# EAGLE design OmniBot_motor_driver (EAGLE 9.4.2)
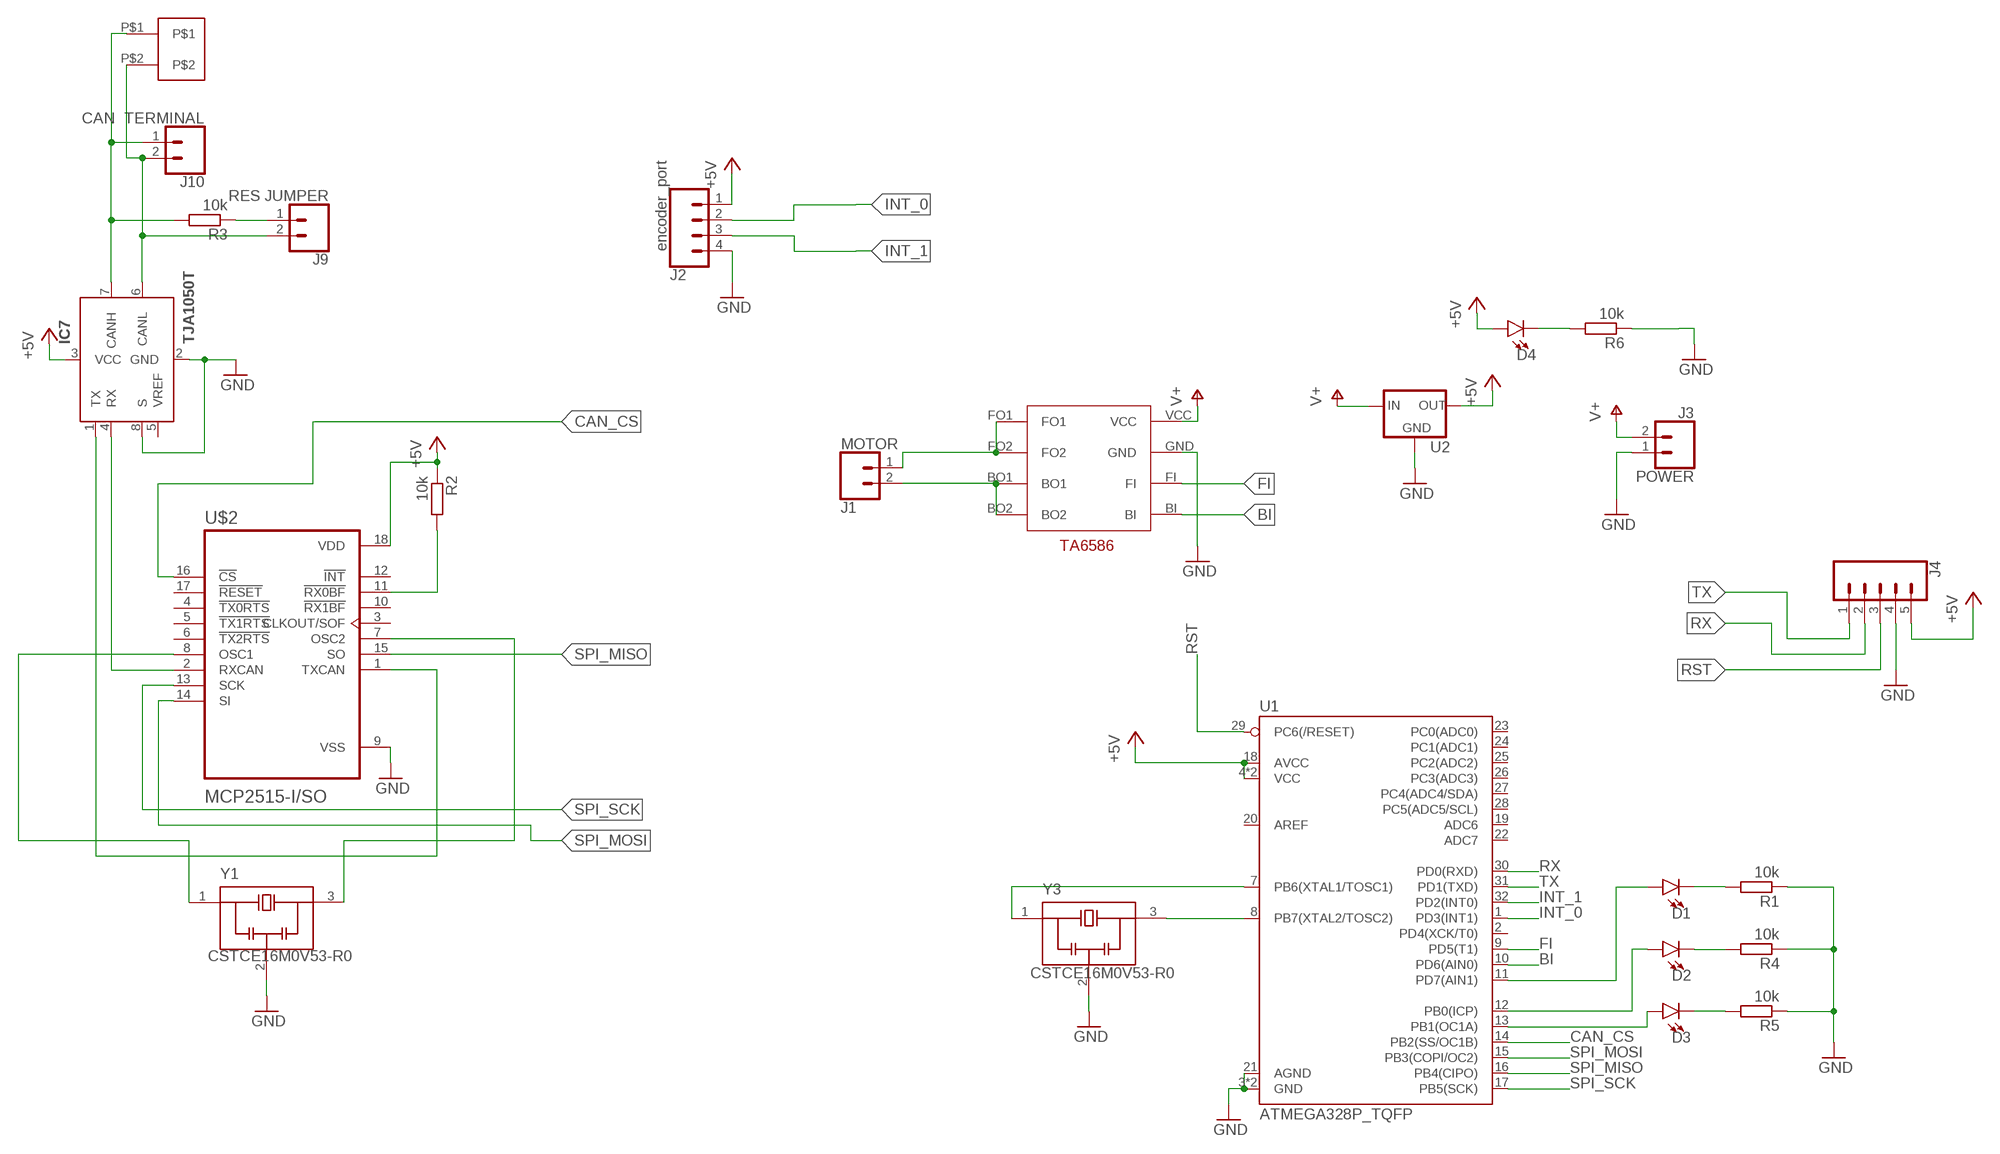
[diagram p0: schematic, sheet 1]

## Parts
D1  LED3MM  [LED_3MM]
D2  LED3MM  [LED_3MM]
D3  LED3MM  [LED_3MM]
D4  LED3MM  [LED_3MM]
IC7  TJA1050T  [SOIC8]
J1  MOTOR  CONN_025MM  [SCREWTERMINAL-5MM-2]
J2  encoder_port  CONN_04POLAR  [MOLEX-1X4]
J3  POWER  CONN_025MM  [SCREWTERMINAL-5MM-2]
J4  CONN_05PTH  [1X05]
J9  RES JUMPER  CONN_02  [1X02]
J10  CAN TERMINAL  CONN_025MM  [SCREWTERMINAL-5MM-2]
R1  10k  R-EU_R0805  [R0805]
R2  10k  R-EU_R0805  [R0805]
R3  10k  R-EU_R0805  [R0805]
R4  10k  R-EU_R0805  [R0805]
R5  10k  R-EU_R0805  [R0805]
R6  10k  R-EU_R0805  [R0805]
U1  ATMEGA328P_TQFP  [TQFP32-08]
U2  V_REG_78XXSINK  [TO220-IGO]
U$1  15EDGRC-3.5-2P  [15EDGRC-3.5-2P-PAK]
U$2  MCP2515-I/SO  [SOIC127P1030X265-18N]
U$3  TA6586  [TA6586-FOOTPRINT]
Y1  CSTCE16M0V53-R0  [OSC_CSTCE16M0V53-R0]
Y3  CSTCE16M0V53-R0  [OSC_CSTCE16M0V53-R0]

## Nets
+5V: D4.A IC7.3(VCC) J2.1 J4.5 R2.1 U1.4(VCC) U1.6(VCC) U1.18(AVCC) U2.OUT U$2.18(VDD)
BI: U1.10(PD6(AIN0)) U$3.BI
CAN_CS: U1.14(PB2(SS/OC1B)) U$2.16(!CS)
FI: U1.9(PD5(T1)) U$3.FI
GND: IC7.2(GND) IC7.8(S) J2.4 J3.1 J4.4 R1.1 R4.1 R5.1 R6.1 U1.3(GND) U1.5(GND) U1.21(AGND) U2.GND U$2.9(VSS) U$3.GND Y1.2(GND) Y3.2(GND)
INT_0: J2.2 U1.1(PD3(INT1))
INT_1: J2.3 U1.32(PD2(INT0))
N$1: U1.8(PB7(XTAL2/TOSC2)) Y3.3(OUT)
N$2: U$2.8(OSC1) Y1.1(IN)
N$3: U1.7(PB6(XTAL1/TOSC1)) Y3.1(IN)
N$4: IC7.1(TX) U$2.1(TXCAN)
N$5: IC7.4(RX) U$2.2(RXCAN)
N$6: R2.2 U$2.11(!RX0BF)
N$7: J1.1 U$3.FO1 U$3.FO2
N$8: J1.2 U$3.BO1 U$3.BO2
N$9: U$2.7(OSC2) Y1.3(OUT)
N$10: IC7.6(CANL) J9.2 J10.2 U$1.P$2
N$11: D1.A U1.11(PD7(AIN1))
N$12: J9.1 R3.1
N$13: IC7.7(CANH) J10.1 R3.2 U$1.P$1
N$14: D2.A U1.12(PB0(ICP))
N$15: D3.A U1.13(PB1(OC1A))
N$16: D1.K(C) R1.2
N$17: D2.K(C) R4.2
N$18: D3.K(C) R5.2
N$19: D4.K(C) R6.2
RST: J4.3 U1.29(PC6(/RESET))
RX: J4.2 U1.30(PD0(RXD))
SPI_MISO: U1.16(PB4(CIPO)) U$2.15(SO)
SPI_MOSI: U1.15(PB3(COPI/OC2)) U$2.14(SI)
SPI_SCK: U1.17(PB5(SCK)) U$2.13(SCK)
TX: J4.1 U1.31(PD1(TXD))
V+: J3.2 U2.IN U$3.VCC
Unconnected: IC7.5(VREF) U1.2(PD4(XCK/T0)) U1.19(ADC6) U1.20(AREF) U1.22(ADC7) U1.23(PC0(ADC0)) U1.24(PC1(ADC1)) U1.25(PC2(ADC2)) U1.26(PC3(ADC3)) U1.27(PC4(ADC4/SDA)) U1.28(PC5(ADC5/SCL)) U$2.3(CLKOUT/SOF) U$2.4(!TX0RTS) U$2.5(!TX1RTS) U$2.6(!TX2RTS) U$2.10(!RX1BF) U$2.12(!INT) U$2.17(!RESET)

## Library data of the parts
D1-D4 = SparkFun-LED:LED: LED (Generic) Standard schematic elements and footprints for 5mm, 3mm, 1206, and 0603 sized LEDs. Generic LEDs with no color specified.; PROD_ID: DIO-08794
IC7 = TJA1050:TJA1050; MF: NXP; MPN: TJA1050T
J1 J3 J10 = SparkFun-Connectors:CONN_02: Multi connection point. Often used as Generic Header-pin footprint for 0.1 inch spaced/style header connections On any of the 0.1 inch spaced packages, you can populate with these: Break Away Headers - Straight <https://www.sparkfun.com/products/116> (PRT-00116) Break Away Male Headers - Right Angle <https://www.sparkfun.com/products/553> (PRT-00553) Female Headers <https://www.sparkfun.com/products/115> (PRT-00115) Break Away Headers - Machine Pin <https://www.sparkfun.com/products/117> (PRT-00117) Break Away Female Headers - Swiss Machine Pin <https://www.sparkfun.com/products/743> (PRT-00743) For SCREWTERMINALS and SPRING TERMINALS visit here: Screw Terimnals on SparkFun.com <https://www.sparkfun.com/search/results?term=Screw+Terminals> (5mm/3.5mm/2.54mm spacing) This device is also useful as a general connection point to wire up your design to another part of your project. Our various solder wires solder well into these plated through hole pads. Hook-Up Wire - Assortment (Stranded, 22 AWG) <https://www.sparkfun.com/products/11375> (PRT-11375) Hook-Up Wire - Assortment (Solid Core, 22 AWG) <https://www.sparkfun.com/products/11367> (PRT-11367) View the entire wire category on our website here <https://www.sparkfun.com/categories/141> Special notes: Molex polarized connector foot print use with: PRT-08233 with associated crimp pins and housings. 2.54_SCREWTERM for use with PRT-10571. 3.5mm Screw Terminal footprints for PRT-08084 5mm Screw Terminal footprints for use with PRT-08432; SF_SKU: PRT-08432
J2 = SparkFun-Connectors:CONN_04: Multi connection point. Often used as Generic Header-pin footprint for 0.1 inch spaced/style header connections On any of the 0.1 inch spaced packages, you can populate with these: Break Away Headers - Straight <https://www.sparkfun.com/products/116> (PRT-00116) Break Away Male Headers - Right Angle <https://www.sparkfun.com/products/553> (PRT-00553) Female Headers <https://www.sparkfun.com/products/115> (PRT-00115) Break Away Headers - Machine Pin <https://www.sparkfun.com/products/117> (PRT-00117) Break Away Female Headers - Swiss Machine Pin <https://www.sparkfun.com/products/743> (PRT-00743) For SCREWTERMINALS and SPRING TERMINALS visit here: Screw Terimnals on SparkFun.com <https://www.sparkfun.com/search/results?term=Screw+Terminals> (5mm/3.5mm/2.54mm spacing) This device is also useful as a general connection point to wire up your design to another part of your project. Our various solder wires solder well into these plated through hole pads. Hook-Up Wire - Assortment (Stranded, 22 AWG) <https://www.sparkfun.com/products/11375> (PRT-11375) Hook-Up Wire - Assortment (Solid Core, 22 AWG) <https://www.sparkfun.com/products/11367> (PRT-11367) View the entire wire category on our website here <https://www.sparkfun.com/categories/141> Special notes: Molex polarized connector foot print use with SKU : PRT-08231 with associated crimp pins and housings. 1MM SMD Version SKU: PRT-10208; PROD_ID: CONN-08186; SF_ID: PRT-08231
J4 = SparkFun-Connectors:CONN_05: Multi connection point. Often used as Generic Header-pin footprint for 0.1 inch spaced/style header connections On any of the 0.1 inch spaced packages, you can populate with these: Break Away Headers - Straight <https://www.sparkfun.com/products/116> (PRT-00116) Break Away Male Headers - Right Angle <https://www.sparkfun.com/products/553> (PRT-00553) Female Headers <https://www.sparkfun.com/products/115> (PRT-00115) Break Away Headers - Machine Pin <https://www.sparkfun.com/products/117> (PRT-00117) Break Away Female Headers - Swiss Machine Pin <https://www.sparkfun.com/products/743> (PRT-00743) For SCREWTERMINALS and SPRING TERMINALS visit here: Screw Terimnals on SparkFun.com <https://www.sparkfun.com/search/results?term=Screw+Terminals> (5mm/3.5mm/2.54mm spacing) This device is also useful as a general connection point to wire up your design to another part of your project. Our various solder wires solder well into these plated through hole pads. Hook-Up Wire - Assortment (Stranded, 22 AWG) <https://www.sparkfun.com/products/11375> (PRT-11375) Hook-Up Wire - Assortment (Solid Core, 22 AWG) <https://www.sparkfun.com/products/11367> (PRT-11367) View the entire wire category on our website here <https://www.sparkfun.com/categories/141> Special notes: Molex polarized connector foot print use with SKU : PRT-08231 with associated crimp pins and housings. 1MM SMD Version SKU: PRT-10208
J9 = SparkFun-Connectors:CONN_02: Multi connection point. Often used as Generic Header-pin footprint for 0.1 inch spaced/style header connections On any of the 0.1 inch spaced packages, you can populate with these: Break Away Headers - Straight <https://www.sparkfun.com/products/116> (PRT-00116) Break Away Male Headers - Right Angle <https://www.sparkfun.com/products/553> (PRT-00553) Female Headers <https://www.sparkfun.com/products/115> (PRT-00115) Break Away Headers - Machine Pin <https://www.sparkfun.com/products/117> (PRT-00117) Break Away Female Headers - Swiss Machine Pin <https://www.sparkfun.com/products/743> (PRT-00743) For SCREWTERMINALS and SPRING TERMINALS visit here: Screw Terimnals on SparkFun.com <https://www.sparkfun.com/search/results?term=Screw+Terminals> (5mm/3.5mm/2.54mm spacing) This device is also useful as a general connection point to wire up your design to another part of your project. Our various solder wires solder well into these plated through hole pads. Hook-Up Wire - Assortment (Stranded, 22 AWG) <https://www.sparkfun.com/products/11375> (PRT-11375) Hook-Up Wire - Assortment (Solid Core, 22 AWG) <https://www.sparkfun.com/products/11367> (PRT-11367) View the entire wire category on our website here <https://www.sparkfun.com/categories/141> Special notes: Molex polarized connector foot print use with: PRT-08233 with associated crimp pins and housings. 2.54_SCREWTERM for use with PRT-10571. 3.5mm Screw Terminal footprints for PRT-08084 5mm Screw Terminal footprints for use with PRT-08432
R1-R6 = resistor:R-EU_: RESISTOR, European symbol
U1 = SparkFun-IC-Microcontroller:ATMEGA328P_TQFP: Popular 328P in QFP Storefront component: ATmega328 - TQFP <https://www.sparkfun.com/products/13448> (COM-13448) Datasheet <http://www.sparkfun.com/datasheets/Components/SMD/ATMega328.pdf> SparkFun Products SparkFun RedBoard - Programmed with Arduino <https://www.sparkfun.com/products/12757> (DEV-12757) Arduino Pro Mini 328 - 5V/16MHz <https://www.sparkfun.com/products/11113> (DEV-11113) Arduino Pro Mini 328 - 3.3V/8MHz <https://www.sparkfun.com/products/11114> (DEV-11114) SparkFun OpenLog <https://www.sparkfun.com/products/13712> (DEV-13712) SparkFun MicroView - OLED Arduino Module <https://www.sparkfun.com/products/12923> (DEV-12923) SparkFun Digital Sandbox <https://www.sparkfun.com/products/12651> (DEV-12651) SparkFun PicoBoard <https://www.sparkfun.com/products/11888> (WIG-11888) Arduino Fio <https://www.sparkfun.com/products/10116> (DEV-10116) LilyPad Arduino 328 Main Board <https://www.sparkfun.com/products/13342> (DEV-13342) SparkFun RedStick <https://www.sparkfun.com/products/13741> (DEV-13741) LilyPad MP3 <https://www.sparkfun.com/products/11013> (DEV-11013) LilyPad Arduino SimpleSnap <https://www.sparkfun.com/products/10941> (DEV-10941) SparkFun Stepoko <https://www.sparkfun.com/products/13899> (ROB-13899) SparkFun Geiger Counter <https://www.sparkfun.com/products/11345> (SEN-11345) SparkFun EL Sequencer <https://www.sparkfun.com/products/12781> (COM-12781) Arduino Pro 328 - 5V/16MHz <https://www.sparkfun.com/products/10915> (DEV-10915) CryptoCape <https://www.sparkfun.com/products/12773> (DEV-12773) SparkFun IR Thermometer Evaluation Board - MLX90614 <https://www.sparkfun.com/products/10740> (SEN-10740) SparkFun RedBot Mainboard <https://www.sparkfun.com/products/12097> (ROB-12097) Arduino Pro 328 - 3.3V/8MHz <https://www.sparkfun.com/products/10914> (DEV-10914) SparkFun Block for Intel® Edison - Arduino <https://www.sparkfun.com/products/13036> (DEV-13036) SparkFun Simon Says - Surface Mount Soldering Kit <https://www.sparkfun.com/products/10935> (KIT-10935) SparkFun 7-Segment Serial Display - Red <https://www.sparkfun.com/products/11441> (COM-11441) SparkFun 7-Segment Serial Display - White <https://www.sparkfun.com/products/11629> (COM-11629) SparkFun 7-Segment Serial Display - Yellow <https://www.sparkfun.com/products/11443> (COM-11443) SparkFun 7-Segment Serial Display - Kelly Green <https://www.sparkfun.com/products/11440> (COM-11440) SparkFun 7-Segment Serial Display - Blue <https://www.sparkfun.com/products/11442> (COM-11442) SparkFun OpenSegment Serial Display - 20mm (Blue) <https://www.sparkfun.com/products/11647> (COM-11647) SparkFun OpenSegment Serial Display - 20mm (Green) <https://www.sparkfun.com/products/11646> (COM-11646) SparkFun OpenSegment Serial Display - 20mm (White) <https://www.sparkfun.com/products/11648> (COM-11648) SparkFun OpenSegment Serial Display - 20mm (Red) <https://www.sparkfun.com/products/11644> (COM-11644) SparkFun OpenSegment Serial Display - 20mm (Yellow) <https://www.sparkfun.com/products/11645> (COM-11645) SparkFun OpenSegment Shield <https://www.sparkfun.com/products/13190> (DEV-13190); PROD_ID: IC-09069
U2 = SparkFun-IC-Power:V_REG_78XX: Voltage Regulator Standard 78xx regulator. IGO (Input Ground Output). Spark Fun Electronics SKU : COM-00107
U$1 = 15EDGRC-3.5-2P:15EDGRC-3.5-2P: Check availability <https://pricing.snapeda.com/parts/15EDGRC-3.5/2P/Degson/view-part?ref=eda>; AVAILABILITY: Not in stock; CHECK_PRICES: https://www.snapeda.com/parts/15EDGRC-3.5/2P/Degson/view-part/?ref=eda; DESCRIPTION: Pluggable terminal block; socket; male; 3.5mm; angled 90°; ways: 2; MF: Degson; MP: 15EDGRC-3.5/2P; PACKAGE: None; PRICE: None; SNAPEDA_LINK: https://www.snapeda.com/parts/15EDGRC-3.5/2P/Degson/view-part/?ref=snap
U$2 = MCP2515-I_SO:MCP2515-I/SO: Check availability <https://pricing.snapeda.com/parts/MCP2515-I/SO/Microchip/view-part?ref=eda>; AVAILABILITY: In Stock; CHECK_PRICES: https://www.snapeda.com/parts/MCP2515-I/SO/Microchip/view-part/?ref=eda; DESCRIPTION: Microchip CAN Controller 1Mbit/s CAN 2.0B 18-Pin SOIC W | Microchip Technology Inc. MCP2515-I/SO; MF: Microchip; MP: MCP2515-I/SO; PACKAGE: SOIC-18 Microchip; PRICE: None; PURCHASE-URL: https://www.snapeda.com/api/url_track_click_mouser/?unipart_id=39881&manufacturer=Microchip&part_name=MCP2515-I/SO&search_term=None; SNAPEDA_LINK: https://www.snapeda.com/parts/MCP2515-I/SO/Microchip/view-part/?ref=snap
U$3 = TA6586:TA6586: Check availability <https://pricing.snapeda.com/parts/TA6586/Wuxi/view-part?ref=eda>; AVAILABILITY: Not in stock; CHECK_PRICES: https://www.snapeda.com/parts/TA6586/Wuxi/view-part/?ref=eda; DESCRIPTION: DC Bidirectional motor driving circuit; MF: Wuxi; MP: TA6586; PACKAGE: Package; PRICE: None; SNAPEDA_LINK: https://www.snapeda.com/parts/TA6586/Wuxi/view-part/?ref=snap
Y1 Y3 = CSTCE16M0V53-R0:CSTCE16M0V53-R0: Check availability <https://pricing.snapeda.com/parts/CSTCE16M0V53-R0/Murata/view-part?ref=eda>; AVAILABILITY: In Stock; CHECK_PRICES: https://www.snapeda.com/parts/CSTCE16M0V53-R0/Murata+Electronics+North+America/view-part/?ref=eda; DESCRIPTION: 16 MHz Ceramic Resonator Built in Capacitor 15 pF ±0.3% -20°C ~ 80°C Surface Mount; MF: Murata; MP: CSTCE16M0V53-R0; PACKAGE: SMD-3 Murata; PRICE: None; SNAPEDA_LINK: https://www.snapeda.com/parts/CSTCE16M0V53-R0/Murata+Electronics+North+America/view-part/?ref=snap

## Net classes
0 default: width 0.5 mm, drill 1.2 mm, clearance 0.2 mm

## Board
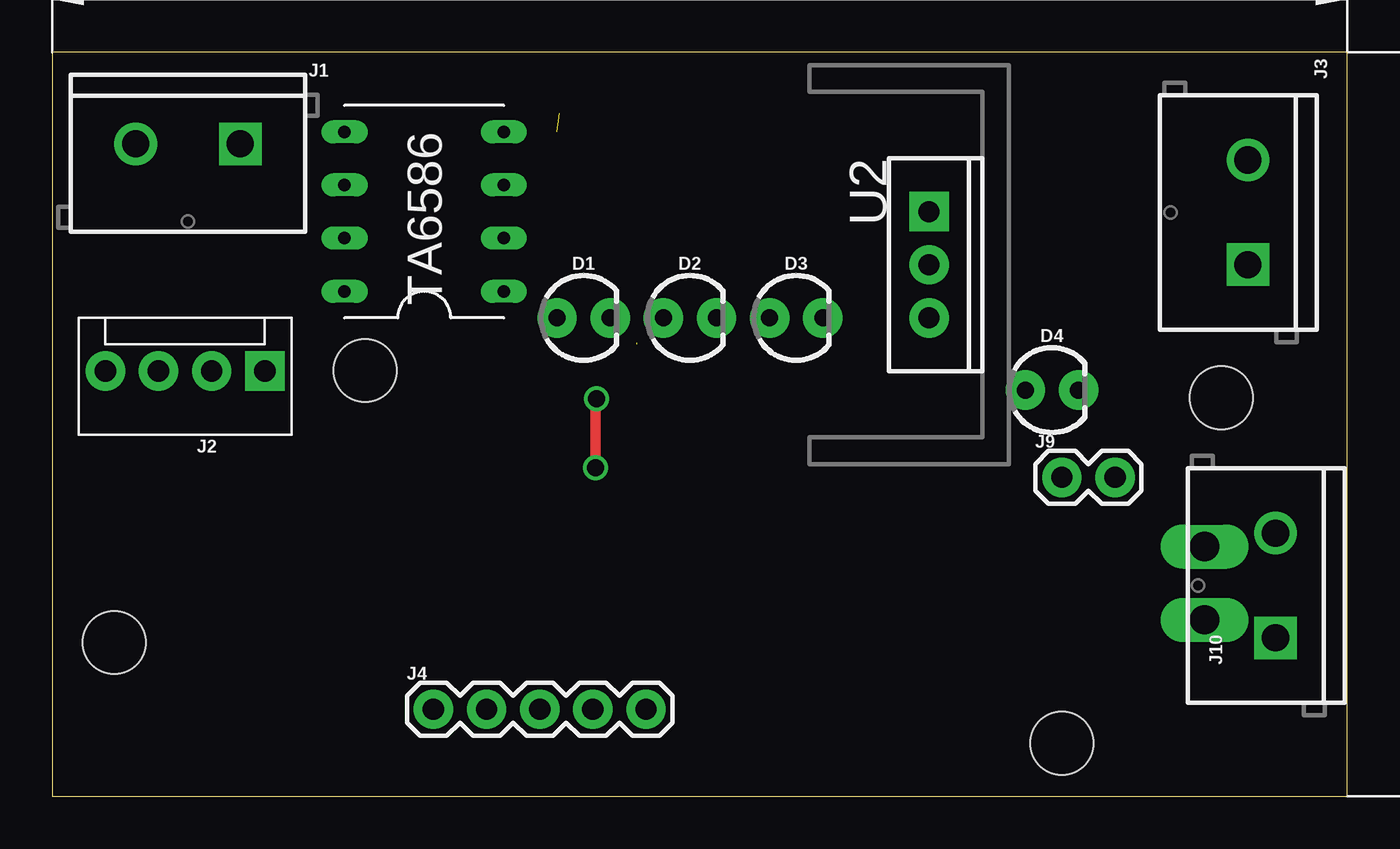
[diagram p1: board, top side]
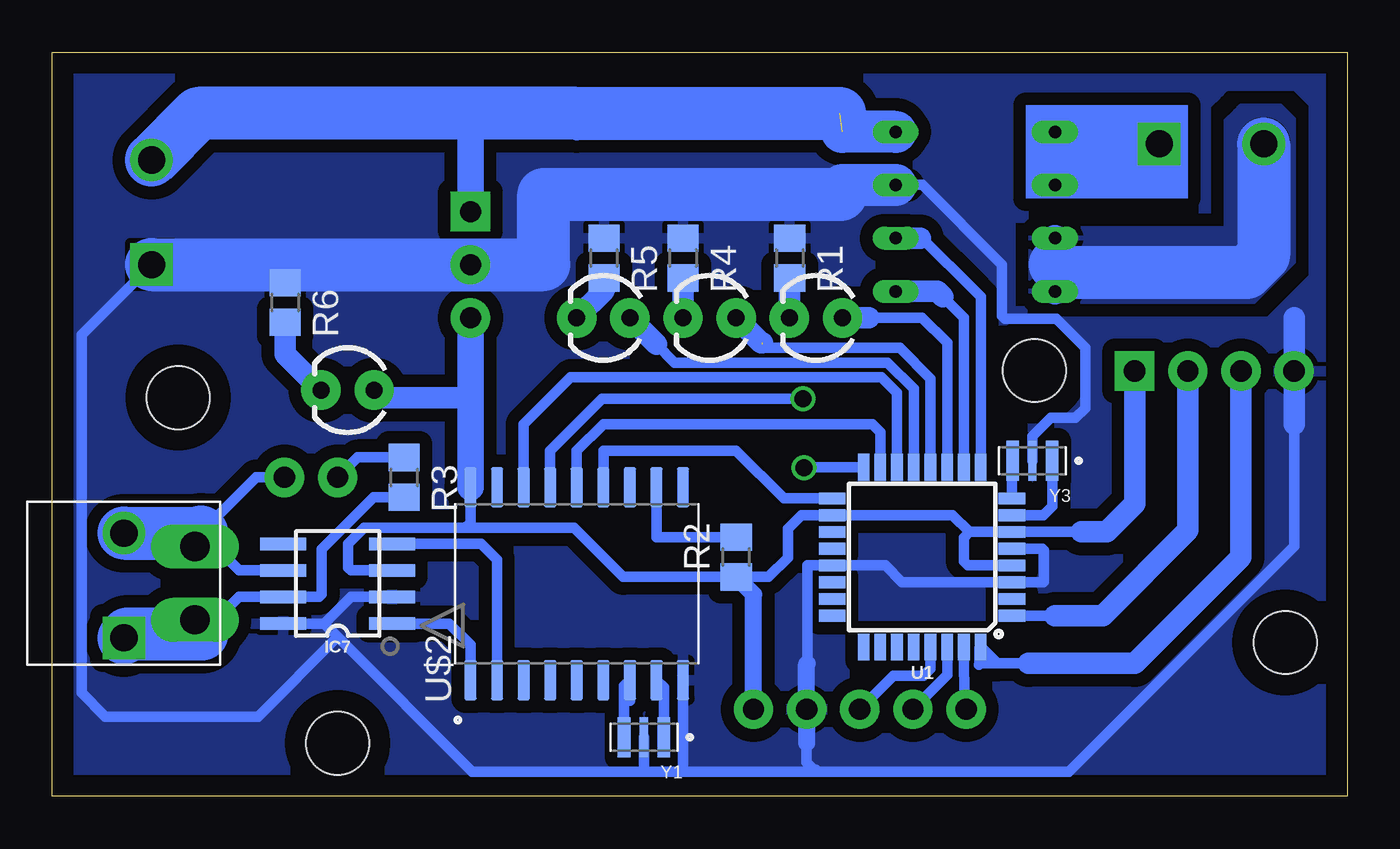
[diagram p2: board, bottom side, seen from below]

Size 61.9 x 35.55 mm. Coordinates in mm from the lower left corner, seen from the top.
Outline: 0,0 61.9,0 61.9,35.55 0,35.55 0,0
Copper layers (1*16): Top 0.035mm / dielectric 1.5mm / Bottom 0.035mm
Design rules "default": minimum track width 6mil, minimum drill 0.35mm, track to track 6mil, track to pad 6mil, pad to pad 6mil, via to via 6mil, smd to smd 6mil, copper to edge 40mil, drill to drill 6mil, minimum pad ring 10mil, minimum via ring 8mil, stop-mask expansion 4mil, vias tented up to drill 0mil, thermal gap 10mil
Holes 3 mm at 2.97,7.35 48.26,2.54 55.88,19.05 14.95,20.34

### Footprints (pad centres in the part's own frame; a part is rotated, then mirrored left to right if it is on the bottom)
LED_3MM = drill 0.813 pad 1.88: A -1.27,0; K 1.27,0
SOIC8 = smd 2.2 x 0.6: 1 -2.6,1.905; 2 -2.6,0.635; 3 -2.6,-0.635; 4 -2.6,-1.905; 5 2.6,-1.905; 6 2.6,-0.635; 7 2.6,0.635; 8 2.6,1.905
SCREWTERMINAL-5MM-2 = drill 1.3 pad 2.032 square: 1 0,0 | drill 1.3 pad 2.032: 2 5,0
MOLEX-1X4 = drill 1.016 pad 1.88 square: 1 0,0 | drill 1.016 pad 1.88: 2 2.54,0; 3 5.08,0; 4 7.62,0
1X05 = drill 1.016 pad 1.88: 1 0,0; 2 2.54,0; 3 5.08,0; 4 7.62,0; 5 10.16,0
1X02 = drill 1.016 pad 1.88: 1 0,0; 2 2.54,0
R0805 = smd 1.3 x 1.5: 1 -0.95,0; 2 0.95,0
TQFP32-08 = smd 1.27 x 0.559: 1 -4.293,2.8; 2 -4.293,2; 3 -4.293,1.2; 4 -4.293,0.4; 5 -4.293,-0.4; 6 -4.293,-1.2; 7 -4.293,-2; 8 -4.293,-2.8; 17 4.293,-2.8; 18 4.293,-2; 19 4.293,-1.2; 20 4.293,-0.4; 21 4.293,0.4; 22 4.293,1.2; 23 4.293,2; 24 4.293,2.8 | smd 0.559 x 1.27: 9 -2.8,-4.293; 10 -2,-4.293; 11 -1.2,-4.293; 12 -0.4,-4.293; 13 0.4,-4.293; 14 1.2,-4.293; 15 2,-4.293; 16 2.8,-4.293; 25 2.8,4.293; 26 2,4.293; 27 1.2,4.293; 28 0.4,4.293; 29 -0.4,4.293; 30 -1.2,4.293; 31 -2,4.293; 32 -2.8,4.293
TO220-IGO = drill 1 pad 1.88: GND 0,0; OUT 2.54,0 | drill 1 pad 1.88 square: IN -2.54,0
15EDGRC-3.5-2P-PAK = drill 1.4 long: P$1 -1.75,-3.4; P$2 1.75,-3.4
SOIC127P1030X265-18N = smd 1.91 x 0.6: 1 -4.61,5.08; 2 -4.61,3.81; 3 -4.61,2.54; 4 -4.61,1.27; 5 -4.61,0; 6 -4.61,-1.27; 7 -4.61,-2.54; 8 -4.61,-3.81; 9 -4.61,-5.08; 10 4.61,-5.08; 11 4.61,-3.81; 12 4.61,-2.54; 13 4.61,-1.27; 14 4.61,0; 15 4.61,1.27; 16 4.61,2.54; 17 4.61,3.81; 18 4.61,5.08
TA6586-FOOTPRINT = drill 0.6 long: BI -3.81,3.81; BO1 3.81,1.27; BO2 3.81,3.81; FI -3.81,1.27; FO1 3.81,-3.81; FO2 3.81,-1.27; GND -3.81,-1.27; VCC -3.81,-3.81
OSC_CSTCE16M0V53-R0 = smd 0.6 x 1.9: 1 -0.95,0; 3 0.95,0 | smd 0.4 x 1.9: 2 0,0

### Placement (x,y rotation side)
D1  25.4,22.86 0 top
D2  30.48,22.86 0 top
D3  35.56,22.86 0 top
D4  47.78,19.41 0 top
IC7  48.26,10.16 180 bottom
J1  8.99,31.17 180 top
J2  10.16,20.32 180 top
J3  57.15,25.4 90 top
J4  18.22,4.16 0 top
J9  48.26,15.24 0 top
J10  58.48,7.57 90 top
R1  26.65,25.72 270 bottom
R2  29.21,11.43 90 bottom
R3  45.09,15.24 270 bottom
R4  31.75,25.72 270 bottom
R5  35.53,25.72 270 bottom
R6  50.77,23.59 270 bottom
U1  20.32,11.43 180 bottom
U2  41.91,25.4 270 top
U$1  58.49,10.18 90 bottom
U$2  36.83,10.16 90 bottom
U$3  17.78,27.94 180 top
Y1  33.62,2.82 180 bottom
Y3  15.05,16.03 180 bottom

### Tracks (layer width: path | path; a pad name or v marks a point on that pad's centre or on a via)
+5V
  Bottom 0.5: U$2.18 41.91,13.08 42.16,12.83 | IC7.3 47.62,10.79 47.75,10.92 47.75,12.06 46.99,12.83 42.16,12.83 | R2.1 34.61,10.48 36.96,12.83 42.16,12.83 | 18.07,12.63 U1.6 12.7,12.63 | 18.07,12.63 18.33,12.37 18.33,11.24 18.13,11.03 U1.4 | 18.07,12.63 18.87,13.43 U1.18 26.08,13.43 26.74,12.77 26.74,11.41 27.67,10.48 R2.1 | 29.05,10.32 R2.1
  Bottom 0.813: J4.5 28.38,9.65 29.05,10.32
  Bottom 1.016: J2.1 10.16,13.97 11.5,12.63 12.7,12.63 | D4.A 46.16,19.05 41.91,19.05
  Bottom 1.27: U2.OUT 41.91,19.05 U$2.18
BI
  Bottom 0.5: 18.32,22.86 19.32,23.86
  Bottom 0.508: U1.10 18.32,22.86
  Bottom 1.016: 19.32,23.86 19.59,24.13 U$3.BI
CAN_CS
  Bottom 0.5: U$2.16 39.37,17.78 37.12,20.02 22.27,20.02 21.52,19.27 U1.14
FI
  Bottom 0.5: 17.78,24.13 20.32,26.67 20.41,26.67
  Bottom 0.508: U1.9 17.52,23.87 17.78,24.13
  Bottom 1.016: U$3.FI 20.41,26.67
GND
  Bottom 0.5: IC7.2 47.62,9.53 48.9,8.26 | 48.9,8.26 IC7.8 | U$2.9 31.75,1.27 31.85,1.17 33.02,1.17 33.61,1.17 33.62,1.18 | 33.62,1.18 Y1.2 | 33.62,1.18 41.82,1.18 48.26,7.62 | 48.9,8.26 48.26,7.62 | U1.5 14.58,11.83 14.5,11.75 14.5,10.25 14.52,10.23 U1.3 21.28,10.23 22.08,11.03 U1.21 25.81,11.03 25.81,6.35 | J3.1 60.49,22.06 60.49,4.94 59.36,3.81 52.07,3.81 48.26,7.62 | 25.84,2.54 25.84,1.61 25.49,1.27 25.4,1.27 | U2.GND 38.41,25.4 38.1,25.4 | U$3.GND 20.31,29.21 16.5,25.41 16.5,22.96 16.36,22.81 13.91,22.81 12.53,21.43 12.53,18.55 13,18.08 14.17,18.08 15.05,17.2 Y3.2 | 13.32,1.17 2.54,11.95 2.54,17.78
  Bottom 0.508: 33.02,1.17 13.32,1.17
  Bottom 0.813: 25.81,6.35 25.84,6.32 J4.4 25.84,2.54
  Bottom 1.016: 2.54,17.78 J2.4 2.54,22.86
  Bottom 1.27: 24.21,28.77 24.13,28.85 24.13,29.21
  Bottom 2: 24.13,29.21 U$3.GND
  Bottom 2.54: J3.1 38.41,25.4 38.41,28.77 24.21,28.77
  pour Bottom (isolate 0.61, rank 3): -1.27,38.1 -1.27,-1.27 63.5,-1.27 63.5,38.1
INT_0
  Bottom 0.5: 13.97,8.63 U1.1
  Bottom 1.016: J2.2 7.62,12.7 11.69,8.63 13.97,8.63
INT_1
  Bottom 0.5: 15.24,6.35 16.73,6.35 | 16.73,6.35 17.56,6.35 17.59,6.32 | 17.62,6.29 17.59,6.32 | 17.59,6.32 17.59,7.07 U1.32 16.73,6.35
  Bottom 1.016: J2.3 5.08,11.43 10.16,6.35 15.24,6.35
N$1
  Bottom 0.5: Y3.3 16.03,16 U1.8
N$2
  Bottom 0.5: Y1.1 32.67,5.2 U$2.8
N$3
  Bottom 0.5: Y3.1 14.1,13.86 14.53,13.43 U1.7
N$4
  Bottom 0.5: U$2.1 41.91,7.24 42.93,8.26 IC7.1
N$5
  Bottom 0.5: U$2.2 40.64,11.3 41.4,12.06 IC7.4
N$6
  Bottom 0.5: R2.2 29.22,12.37 33.02,12.37 U$2.11
N$7
  Bottom 1.27: U$3.FO1 13.97,30.47 U$3.FO2
  Bottom 2.54: 13.97,30.47 13.86,30.58 J1.1 13.39,31.17 U$3.FO1
N$8
  Bottom 1.27: U$3.BO1 13.97,25.4 U$3.BO2
  Bottom 2.54: J1.2 3.99,25.85 4.8,25.04 13.61,25.04 13.97,25.4
  pour Bottom: 2.54,31.75 2.54,25.49 4.39,23.63 4.44,23.59 14.84,23.59 15.16,23.92 15.16,27.19 5.87,27.19 5.82,27.15 5.82,32.32 5.38,32.77 5.11,33.03 3.17,33.03 2.54,32.41
N$9
  Bottom 0.5: 34.29,4.57 U$2.7 34.57,5.27 Y1.3
N$10
  Bottom 0.5: IC7.6 52.96,10.79 54.74,12.57 | J9.2 52.16,15.24 54.78,12.62 54.84,12.57 54.84,12.18 U$1.P$2
  Bottom 2.54: J10.2 54.84,12.57 | 54.78,12.62 54.74,12.57
N$11
  Bottom 0.5: 22.86,22.86 20.32,22.86 19.12,21.66 U1.11
  Bottom 1.016: D1.A 22.86,22.86
N$12
  Bottom 0.5: R3.1 47.31,16.19 J9.1
N$13
  Bottom 0.5: R3.2 46.54,14.29 49.02,11.81 49.02,9.65 49.15,9.53 IC7.7 52.96,9.53 54.74,7.75 | U$1.P$1 57.62,8.43 58.3,7.75
  Bottom 2.54: 54.74,7.75 58.3,7.75 J10.1
N$14  (1 unrouted)
  Bottom 0.5: 27.94,21.59 27.78,21.43 21.38,21.43 19.92,19.96 U1.12
  Bottom 1.016: D2.A 28.03,21.68 27.94,21.68
N$15
  Bottom 0.5: U1.13 20.72,19.48 21.97,20.73 32.16,20.73 33.02,21.59
  Bottom 1.016: D3.A 33.02,21.59
N$16
  Bottom 0.5: 26.65,24.13 R1.2
  Bottom 1.016: D1.K 26.65,22.88 26.65,24.13
N$17
  Bottom 0.5: 31.75,24.13 R4.2
  Bottom 1.016: D2.K 31.75,24.13
N$18
  Bottom 0.5: 35.53,24.16 R5.2
  Bottom 1.016: D3.K 35.53,24.16
N$19
  Bottom 1.016: D4.K 50.77,21.12 R6.2
RST
  Bottom 0.5: U1.29 19.92,6.09 20.25,5.76 21.7,5.76 J4.3
RX
  Bottom 0.5: U1.30 19.12,5.8 J4.2
SPI_MISO  (via drill 0.8)
  Top 0.5: v26.01,19 26.25,18.76 25.97,18.48 v25.97,15.7
  Bottom 0.5: U$2.15 38.1,16.51 35.62,19 v26.01,19 | U1.16 25.95,15.72 v25.97,15.7
SPI_MOSI
  Bottom 0.5: U$2.14 36.83,16.51 35.56,17.78 22.7,17.78 22.32,17.41 U1.15
SPI_SCK
  Bottom 0.5: U$2.13 35.56,16.51 29.21,16.51 26.93,14.23 U1.17
TX
  Bottom 0.5: U1.31 18.31,4.25 J4.1
V+  (1 unrouted)
  Bottom 0.813: 36.83,31.75 36.83,32.63
  Bottom 1.27: U2.IN 41.91,32.63
  Bottom 2: U$3.VCC 24.13,31.75
  Bottom 2.54: J3.2 54.92,32.63 41.91,32.63 36.83,32.63 24.25,32.63
(copper drawn outside any net)
  shapes: Bottom area x1